# EAGLE design uClouds_SE_Control_Board (EAGLE 9.5.2)
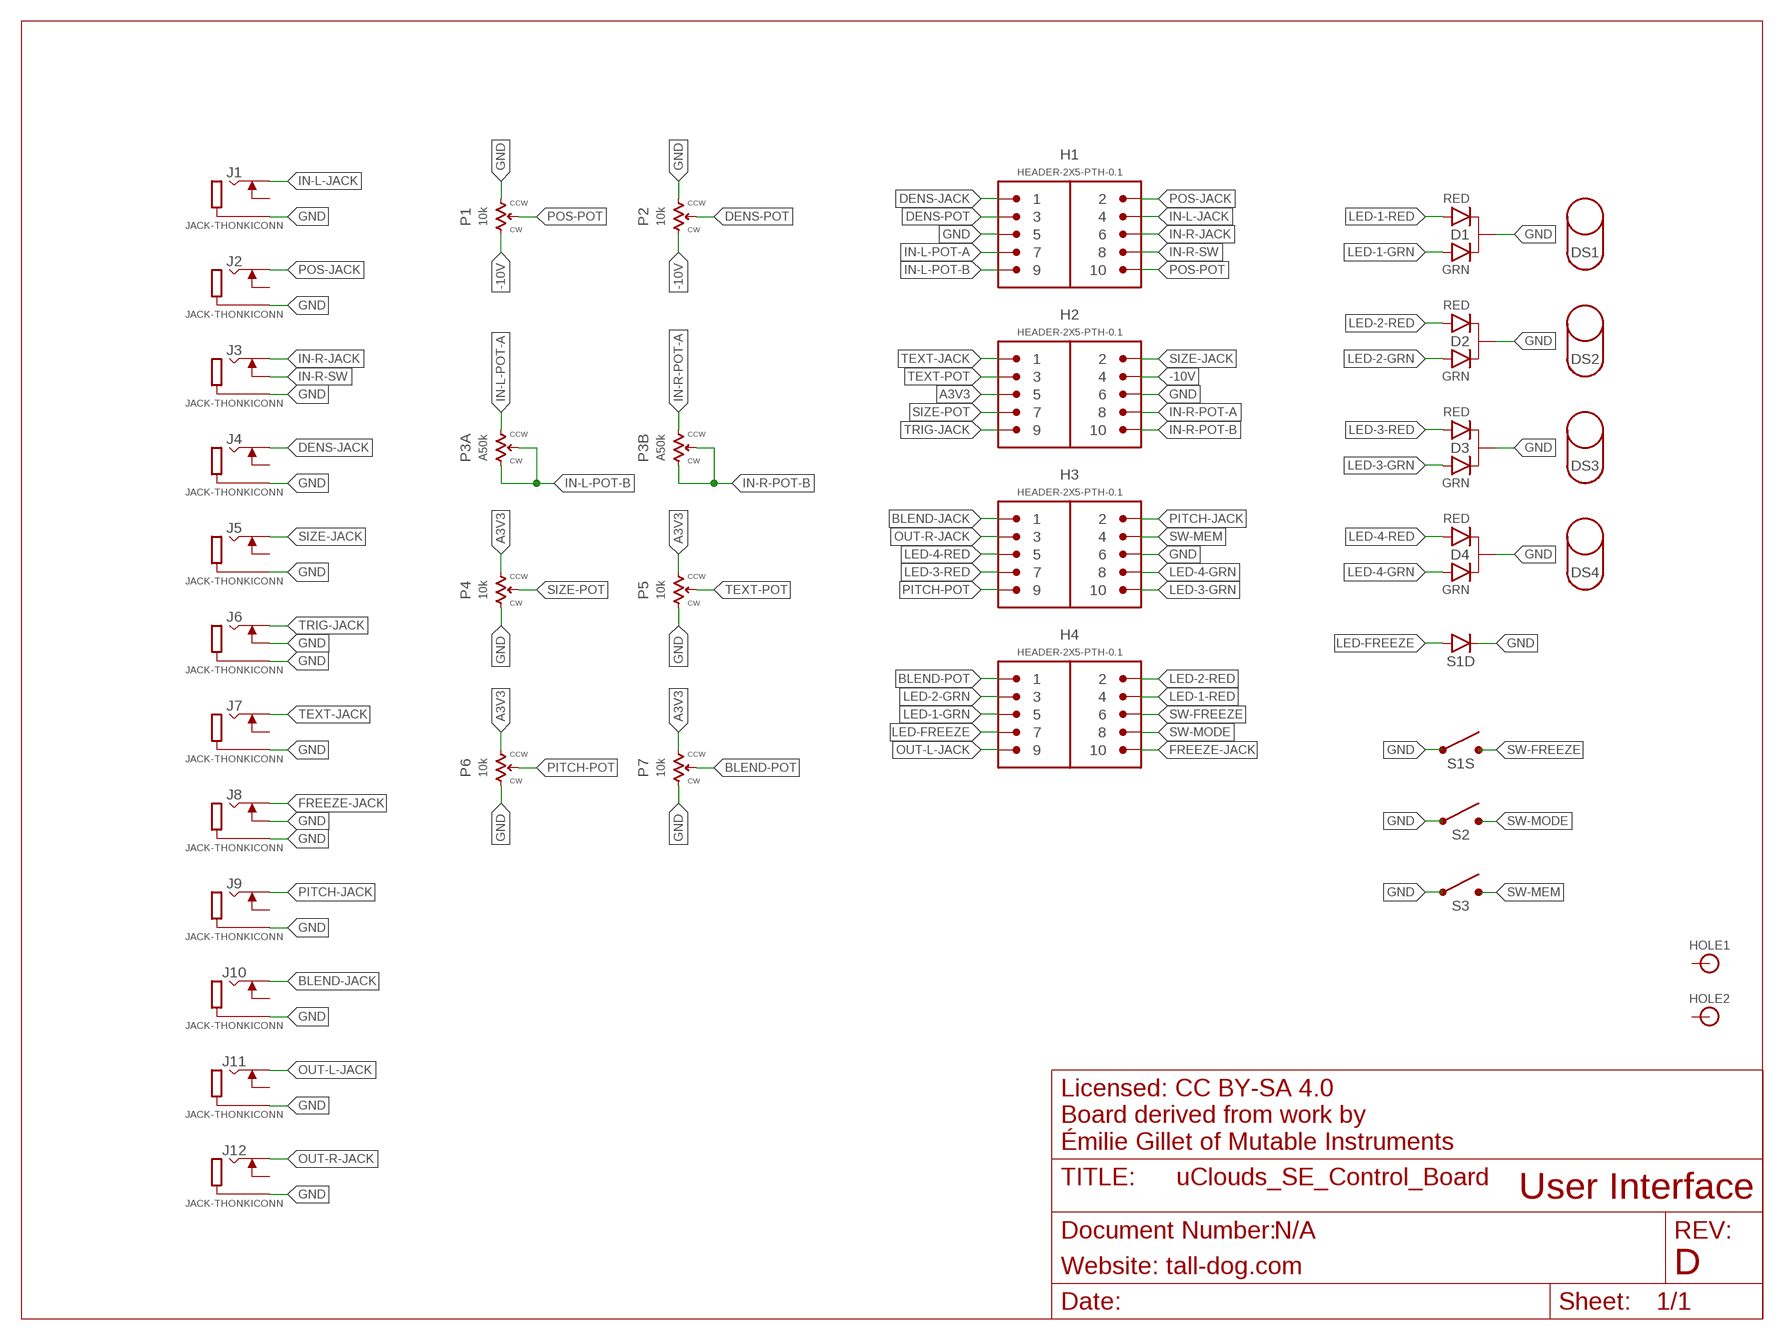
[diagram p0: schematic, sheet 1]

## Parts
D1  LED-DUAL-PTH  [LED-T1-3]
D2  LED-DUAL-PTH  [LED-T1-3]
D3  LED-DUAL-PTH  [LED-T1-3]
D4  LED-DUAL-PTH  [LED-T1-3]
DS1  LED-SPACER  [LED-SPACER]
DS2  LED-SPACER  [LED-SPACER]
DS3  LED-SPACER  [LED-SPACER]
DS4  LED-SPACER  [LED-SPACER]
H1  HEADER-2X5-PTH-0.1  [PTH-0.1-2X5-MALE]
H2  HEADER-2X5-PTH-0.1  [PTH-0.1-2X5-MALE]
H3  HEADER-2X5-PTH-0.1  [PTH-0.1-2X5-MALE]
H4  HEADER-2X5-PTH-0.1  [PTH-0.1-2X5-MALE]
HOLE1  HOLE  [M2.5-HOLE]
HOLE2  HOLE  [M2.5-HOLE]
J1  JACK-THONKICONN  [THONKICONN]
J2  JACK-THONKICONN  [THONKICONN]
J3  JACK-THONKICONN  [THONKICONN]
J4  JACK-THONKICONN  [THONKICONN]
J5  JACK-THONKICONN  [THONKICONN]
J6  JACK-THONKICONN  [THONKICONN]
J7  JACK-THONKICONN  [THONKICONN]
J8  JACK-THONKICONN  [THONKICONN]
J9  JACK-THONKICONN  [THONKICONN]
J10  JACK-THONKICONN  [THONKICONN]
J11  JACK-THONKICONN  [THONKICONN]
J12  JACK-THONKICONN  [THONKICONN]
P1  10k  POT-ALPS-VERT-PS  [POT-R0904N]
P2  10k  POT-ALPS-VERT-PS  [POT-R0904N]
P3  A50k  POT-DUAL  [POT-RK1109G]
P4  10k  POT-ALPS-VERT-PS  [POT-R0904N]
P5  10k  POT-ALPS-VERT-PS  [POT-R0904N]
P6  10k  POT-ALPS-VERT-PS  [POT-R0904N]
P7  10k  POT-ALPS-VERT-PS  [POT-R0904N]
S1  SPST-LED  [TL1265]
S2  SPST-PTH  [TL1105]
S3  SPST-PTH  [TL1105]

## Nets
-10V: H2.4 P1.P$3 P2.P$3
A3V3: H2.5 P4.P$1 P5.P$1 P6.P$1 P7.P$1
BLEND-JACK: H3.1 J10.P3
BLEND-POT: H4.1 P7.P$2
DENS-JACK: H1.1 J4.P3
DENS-POT: H1.3 P2.P$2
FREEZE-JACK: H4.10 J8.P3
GND: D1.2(C) D2.2(C) D3.2(C) D4.2(C) H1.5 H2.6 H3.6 J1.P1 J2.P1 J3.P1 J4.P1 J5.P1 J6.P1 J6.P2 J7.P1 J8.P1 J8.P2 J9.P1 J10.P1 J11.P1 J12.P1 P1.P$1 P2.P$1 P4.P$3 P5.P$3 P6.P$3 P7.P$3 S1.1 S1.2 S1.5(D:C) S2.1 S2.2 S3.1 S3.2
IN-L-JACK: H1.4 J1.P3
IN-L-POT-A: H1.7 P3.1
IN-L-POT-B: H1.9 P3.2 P3.3
IN-R-JACK: H1.6 J3.P3
IN-R-POT-A: H2.8 P3.1'
IN-R-POT-B: H2.10 P3.2' P3.3'
IN-R-SW: H1.8 J3.P2
LED-1-GRN: D1.3(GRN) H4.5
LED-1-RED: D1.1(RED) H4.4
LED-2-GRN: D2.3(GRN) H4.3
LED-2-RED: D2.1(RED) H4.2
LED-3-GRN: D3.3(GRN) H3.10
LED-3-RED: D3.1(RED) H3.7
LED-4-GRN: D4.3(GRN) H3.8
LED-4-RED: D4.1(RED) H3.5
LED-FREEZE: H4.7 S1.6(D:A)
OUT-L-JACK: H4.9 J11.P3
OUT-R-JACK: H3.3 J12.P3
PITCH-JACK: H3.2 J9.P3
PITCH-POT: H3.9 P6.P$2
POS-JACK: H1.2 J2.P3
POS-POT: H1.10 P1.P$2
SIZE-JACK: H2.2 J5.P3
SIZE-POT: H2.7 P4.P$2
SW-FREEZE: H4.6 S1.3 S1.4
SW-MEM: H3.4 S3.3 S3.4
SW-MODE: H4.8 S2.3 S2.4
TEXT-JACK: H2.1 J7.P3
TEXT-POT: H2.3 P5.P$2
TRIG-JACK: H2.9 J6.P3
Unconnected: HOLE1.P$1 HOLE1.P$2 HOLE1.P$3 HOLE1.P$4 HOLE1.P$5 HOLE1.P$6 HOLE1.P$7 HOLE1.P$8 HOLE1.P$9 HOLE2.P$1 HOLE2.P$2 HOLE2.P$3 HOLE2.P$4 HOLE2.P$5 HOLE2.P$6 HOLE2.P$7 HOLE2.P$8 HOLE2.P$9 J1.P2 J2.P2 J4.P2 J5.P2 J7.P2 J9.P2 J10.P2 J11.P2 J12.P2

## Notes on the sheet
- Licensed: CC BY-SA 4.0
  Board derived from work by
  Émilie Gillet of Mutable Instruments
- User Interface
- N/A
- Website: tall-dog.com | D

## Library data of the parts
D1-D4 = uClouds_SE_Library:LED-DUAL
DS1-DS4 = uClouds_SE_Library:LED-SPACER
H1-H4 = uClouds_SE_Library:HEADER-2X5
HOLE1 HOLE2 = uClouds_SE_Library:HOLE
J1-J12 = uClouds_SE_Library:JACK
P1 P2 P4-P7 = uClouds_SE_Library:POT
P3 = uClouds_SE_Library:POT-DUAL
S1 = uClouds_SE_Library:SPST-LED
S2 S3 = uClouds_SE_Library:SPST

## Board
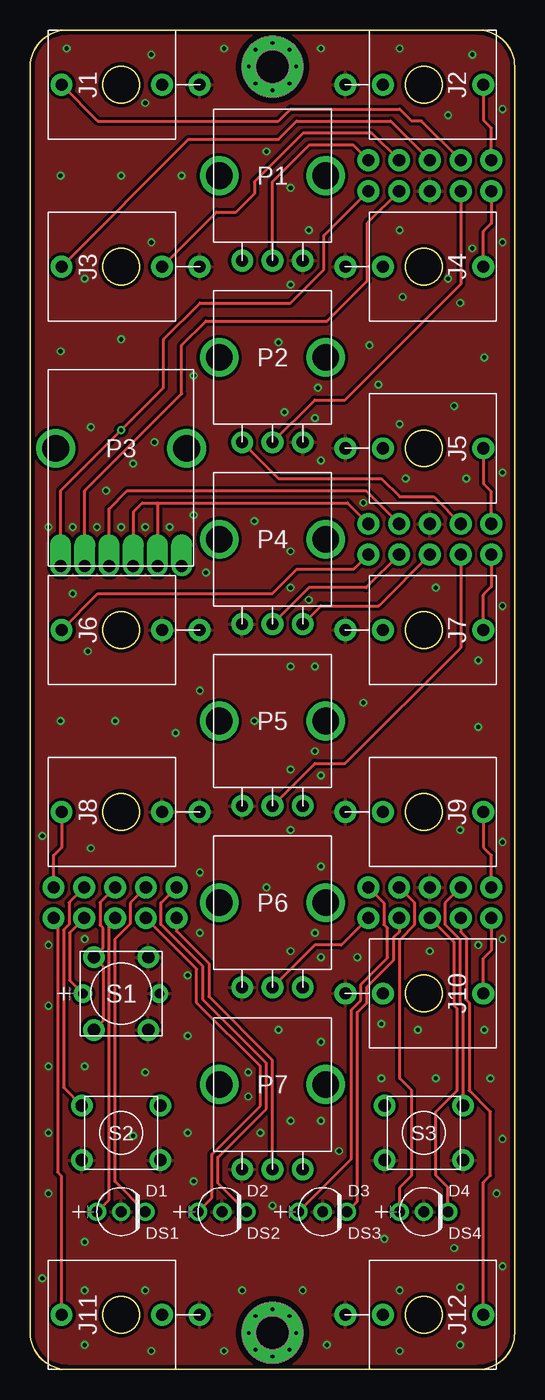
[diagram p1: board, top side]
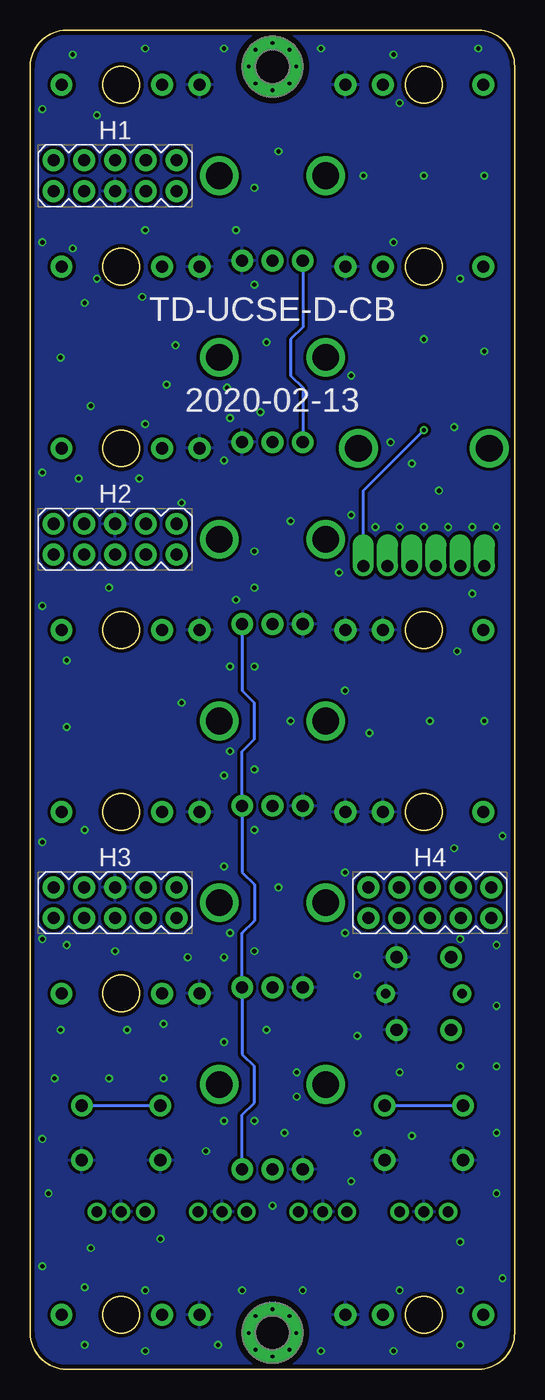
[diagram p2: board, bottom side, seen from below]

Size 40 x 110.5 mm. Coordinates in mm from the lower left corner, seen from the top.
Outline: 3,0 37,0 arc90 40,3 40,107.5 arc90 37,110.5 3,110.5 arc90 0,107.5 0,3 arc90 3,0
Copper layers (1*16): Top 0.035mm / dielectric 1.5mm / Bottom 0.035mm
Design rules "brds *": minimum track width 0.25mm, minimum drill 0.25mm, track to track 6mil, track to pad 6mil, pad to pad 6mil, via to via 6mil, smd to smd 0mil, copper to edge 12mil, drill to drill 8mil, minimum pad ring 6mil, minimum via ring 6mil, stop-mask expansion 0mil, vias tented up to drill 0.35mm, thermal gap 10mil

### Footprints (pad centres in the part's own frame; a part is rotated, then mirrored left to right if it is on the bottom)
LED-T1-3 = drill 0.9 pad 1.5: 1 -2,0; 2 0,0; 3 2,0
PTH-0.1-2X5-MALE = drill 1 pad 1.8: 1 -5.08,-1.27; 2 -5.08,1.27; 3 -2.54,-1.27; 4 -2.54,1.27; 5 0,-1.27; 6 0,1.27; 7 2.54,-1.27; 8 2.54,1.27; 9 5.08,-1.27; 10 5.08,1.27
M2.5-HOLE = drill 2.75 pad 5: P$1 0,0 | drill 0.3: P$2 0,1.95; P$3 0,-1.95; P$4 -1.95,0; P$5 1.95,0; P$6 1.4,1.4; P$7 -1.4,1.4; P$8 -1.4,-1.4; P$9 1.4,-1.4
THONKICONN = drill 1 pad 1.8: P1 0,-6.48; P2 0,-3.38; P3 0,4.92 | hole 3: 0,0
POT-R0904N = drill 1 pad 1.8: P$1 -2.5,7; P$2 0,7; P$3 2.5,7 | drill 2.2 pad 3.2: P$4 -4.4,0; P$5 4.4,0
POT-RK1109G = drill 1 pad 1.75 offset: 1 -3,-9.7; 1' -1,-9.7; 2 -5,-9.7; 2' 1,-9.7; 3 5,-9.7; 3' 3,-9.7 | drill 2.2 pad 3.2: P$4 -5.4,0; P$5 5.4,0
TL1265 = drill 1.016 pad 1.778: 1 -3,2.25; 2 3,2.25; 3 3,-2.25; 4 -3,-2.25 | drill 0.8 pad 1.5: 5 0,3.15; 6 0,-3.15
TL1105 = drill 1.016 pad 1.778: 1 -3.25,-2.25; 2 3.25,-2.25; 3 -3.25,2.25; 4 3.25,2.25

### Placement (x,y rotation side)
D1  7.5,13 180 top
D2  15.85,13 180 top
D3  24.15,13 180 top
D4  32.5,13 180 top
DS1  7.5,13 0 top
DS2  15.85,13 0 top
DS3  24.15,13 0 top
DS4  32.5,13 0 top
H1  33,98.5 0 bottom
H2  33,68.5 0 bottom
H3  33,38.5 0 bottom
H4  7,38.5 0 bottom
HOLE1  20,107.5 0 top
HOLE2  20,3 0 top
J1  7.5,106 90 top
J2  32.5,106 270 top
J3  7.5,91 90 top
J4  32.5,91 270 top
J5  32.5,76 270 top
J6  7.5,61 90 top
J7  32.5,61 270 top
J8  7.5,46 90 top
J9  32.5,46 270 top
J10  32.5,31 270 top
J11  7.5,4.5 90 top
J12  32.5,4.5 270 top
P1  20,98.5 180 top
P2  20,83.5 180 top
P3  7.5,76 0 top
P4  20,68.5 180 top
P5  20,53.5 180 top
P6  20,38.5 180 top
P7  20,23.5 180 top
S1  7.5,31 270 top
S2  7.5,19.5 0 top
S3  32.5,19.5 0 top

### Tracks (layer width: path | path; a pad name or v marks a point on that pad's centre or on a via)
-10V
  Top 0.25: P2.P$3 20.5,73.5 29,73.5 30.5,72 33.31,72 H2.4
  Bottom 0.25: P1.P$3 17.5,86 18.5,85 18.5,82 17.5,81 P2.P$3
A3V3
  Top 0.25: P4.P$1 24,63 28.77,63 H2.5
  Bottom 0.25: P4.P$1 22.5,56 21.5,55 21.5,52 22.5,51 P5.P$1 22.5,41 21.5,40 21.5,37 22.5,36 P6.P$1 22.5,26 21.5,25 21.5,22 22.5,21 P7.P$1
BLEND-JACK
  Top 0.25: J10.P3 37.42,33.92 38.08,34.58 H3.1
BLEND-POT
  Top 0.25: P7.P$2 20,25.5 14.75,30.75 14.75,33.5 12.08,36.17 H4.1
DENS-JACK
  Top 0.25: J4.P3 37.42,93.92 38.08,94.58 H1.1
DENS-POT
  Top 0.25: P2.P$2 23.5,80 26,80 35.54,89.54 H1.3
FREEZE-JACK
  Top 0.25: H4.10 1.92,42.42 2.58,43.08 J8.P3
GND  (via drill 0.35)
  other vias: 33,34.5 33.5,24 38,24 38.5,14.5 35.5,2 24.5,2 16,1.5 4.5,2 10,1.5 1.5,14.5 4.5,25 13,27.5 9.5,24.5 13,19.5 20.5,28 24,27 27,34 32,28 29,28.5 29,24 20,13.5 4.5,10.5 8.5,19.25 4.5,35.5 1.5,35 1.5,25 30.5,1.5 39,8.5 37.5,28 37,35 39,35.5 24,34 23.5,36 21.5,34.5 14,36 19.5,39.75 1,44 5,43 7,53.5 13,32.5 18,24.5 18,22.5 21.5,20.5 24,20.5 25.5,18 19,19.5 13.5,15.5 29.25,10.75 35,10 35.5,6.75 30.5,6.5 22.5,6.5 17.5,6.5 9.5,6.5 4.5,6.5 1,7.5 1.5,19.5 1.5,30 39,19 37,53 18.5,53.5 21.5,67.5 18.5,70 5,77.75 7.5,85 20.5,84.75 28,84.5 37.5,83.5 30.5,94 21.5,97.5 7.5,98.5 2.5,98.5 2.5,84 12,52.5 27.5,55 30.5,78 37,58.5 35.5,44.5 23.5,51 24,49 21.5,49.5 21.5,58 23.5,58 14,41 39,43.5 36.5,108.5 30.5,109 24,109 16,109 10,108.5 3,109 9.5,104.5 34.5,103.5 10,93 4.5,90 12.5,98.5 13.5,82 27.5,71.5 31,73.5 28.75,81.25 23.75,81 23.5,78.5 21,79 39,74 39,93 39,104 39,63 23,94 30.75,88.5 21.5,89.5 14,56 2.5,53.5 21.5,44.5 24,41.5 36,73.5 36.5,92.5 34.5,90 35.5,88 35,79.5 19.5,100.5 24,75 21.5,64.5 23,63.5 33.5,64.5 9.5,69.5 11.5,69.5 7.5,69.5 5.5,69.5 3.5,69.5 1.5,69.5 13.5,70.5 3.5,64 4.75,59.25 14.5,65.75 10.25,76.5 8.5,74.75 6.25,72.5
  pour Bottom (isolate 0.25): 0,110.5 40,110.5 40,0 0,0
  pour Top (isolate 0.25): 0,110.5 40,110.5 40,0 0,0
IN-L-JACK
  Top 0.25: J1.P3 5.58,103 20.5,103 21.5,104 30.5,104 31.5,103 32.31,103 H1.4
IN-L-POT-A
  Top 0.25: H1.7 27.85,94.62 27.85,89.85 24.5,86.5 14.5,86.5 12.5,84.5 12.5,80.5 4.5,72.5 P3.1
IN-L-POT-B  (via drill 0.35)
  Top 0.25: H1.9 24.25,93.56 24.25,90.75 21.5,88 14,88 11,85 11,81 v7.5,77.5 2.5,72.5 P3.2
  Bottom 0.25: P3.3 12.5,72.5 v7.5,77.5
IN-R-JACK
  Top 0.25: H1.6 29.77,103 22,103 20.5,101.5 13.08,101.5 J3.P3
IN-R-POT-A
  Top 0.25: H2.8 27.73,72.5 8,72.5 6.5,71 P3.1'
IN-R-POT-B
  Top 0.25: H2.10 26.19,71.5 10.5,71.5 | 10.5,71.5 9.25,71.5 8.5,70.75 P3.2' | 10.5,71.5 P3.3'
IN-R-SW
  Top 0.25: J3.P2 15.38,95.5 17,95.5 18.5,97 18.5,98 22.5,102 28.23,102 H1.8
LED-1-GRN
  Top 0.25: D1.3 6.5,14 6.5,36.73 H4.5
LED-1-RED
  Top 0.25: D1.1 7,15.5 7,35.5 8.25,36.75 8.25,38.48 H4.4
LED-2-GRN
  Top 0.25: D2.3 15,14.15 15,17.75 19,21.75 19,25 13.75,30.25 13.75,33.02 H4.3
LED-2-RED
  Top 0.25: D2.1 15.5,15.35 15.5,17.5 19.5,21.5 19.5,25.25 14.25,30.5 14.25,33.25 10.8,36.7 10.8,38.49 H4.2
LED-3-GRN
  Top 0.25: H3.10 29.2,38.49 29.2,36.7 29.5,36.4 29.5,33.95 27.3,31.75 27.3,30.45 26.5,29.65 26.5,17.35 D3.3
LED-3-RED
  Top 0.25: H3.7 30.46,36.11 30,35.65 30,33.75 27.8,31.55 27.8,30.25 27,29.45 27,13.85 D3.1
LED-4-GRN
  Top 0.25: D4.3 30.5,15 31.5,16 31.5,23 30.5,24 30.5,35.45 31.7,36.65 31.7,38.53 H3.8
LED-4-RED
  Top 0.25: D4.1 34.5,15 33.5,16 33.5,21.25 35.25,23 35.25,29.75 35,30 35,35.23 H3.5
LED-FREEZE
  Top 0.25: H4.7 3.25,36.02 3.25,32.1 S1.6
OUT-L-JACK
  Top 0.25: J11.P3 2.58,15.92 2.25,16.25 2.25,36.9 H4.9
OUT-R-JACK
  Top 0.25: J12.P3 37.42,15.42 38,16 38,21.25 36.25,23 36.25,30.25 36,30.5 36,35.65 35.54,36.11 H3.3
PITCH-JACK
  Top 0.25: H3.2 38.08,42.42 37.42,43.08 J9.P3
PITCH-POT
  Top 0.25: P6.P$2 23.5,35 25.69,35 H3.9
POS-JACK
  Top 0.25: J2.P3 37.42,103.08 38.08,102.42 H1.2
POS-POT
  Top 0.25: P1.P$2 20,98 23,101 26.69,101 H1.10
SIZE-JACK
  Top 0.25: J5.P3 37.42,73.08 38.08,72.42 H2.2
SIZE-POT
  Top 0.25: P4.P$2 23,64.5 27.73,64.5 H2.7
SW-FREEZE
  Top 0.25: S1.3 6,28.75 6,33.25 S1.4 6,34.75 6,36.4 5.75,36.65 5.75,38.52 H4.6
SW-MEM
  Top 0.25: S3.4 35.75,30 35.5,30.25 35.5,35.45 34.25,36.7 34.25,38.48 H3.4
  Bottom 0.25: S3.3 S3.4
SW-MODE
  Top 0.25: H4.8 3.2,38.51 3.2,36.7 2.75,36.25 2.75,23.25 S2.3
  Bottom 0.25: S2.3 S2.4
TEXT-JACK
  Top 0.25: J7.P3 37.42,63.92 38.08,64.58 H2.1
TEXT-POT
  Top 0.25: P5.P$2 23.5,50 26,50 35.54,59.54 H2.3
TRIG-JACK
  Top 0.25: J6.P3 5.58,64 20,64 22,66 26.69,66 H2.9

### Text on the board
bPlace: TD-UCSE-D-CB | 2020-02-13